# Altium schematic sheet TOP.SchDoc
size A4; SheetNumber: 1; SheetTotal: 4
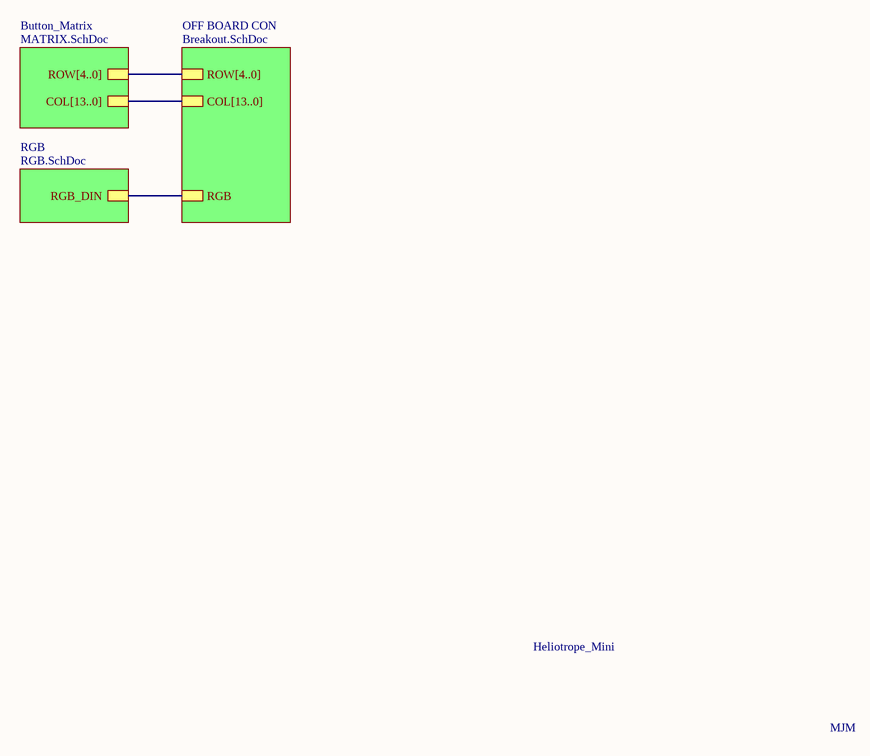
[diagram p0: TOP.SchDoc]

## Sub-sheets
Button_Matrix = MATRIX.SchDoc: ROW[4..0], COL[13..0]
OFF BOARD CON = Breakout.SchDoc: ROW[4..0], COL[13..0], RGB
RGB = RGB.SchDoc: RGB_DIN

## Nets
(unnamed): sheet RGB/RGB_DIN, sheet OFF BOARD CON/RGB

## Buses and harness runs
bus sheet Button_Matrix/COL[13..0] = sheet OFF BOARD CON/COL[13..0]
bus sheet Button_Matrix/ROW[4..0] = sheet OFF BOARD CON/ROW[4..0]

## Notes on the sheet
- Heliotrope_Mini
- MJM